# Altium project amplifier.PrjPcb
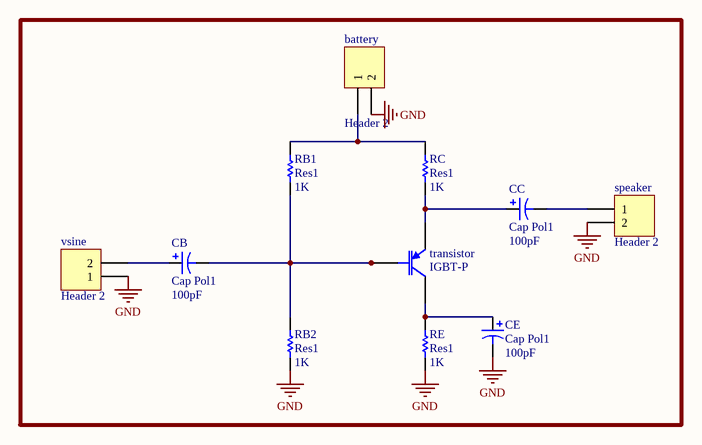
[diagram p0: Sheet2.SchDoc]
1 sheet, 11 parts. Net scope: global (net labels, ports and power ports of the same name join across sheets).
Board file: PCB2.PcbDoc

## Sheet Sheet2.SchDoc
size A4; SheetNumber: 1; SheetTotal: 1; SPICEModelCacheWGIZTEES: <root> / <DocumentId>WGIZTEES</DocumentId> / <CacheFrame Number="0"> / <Model Name="pigbt" Kind="CKT"> / <Text>*PIGBT / *P-IGBT Default  MCE  C G E  5-20-95 / *MCE 600V 40A 24.3ns / *IGBT Pinout: 1=C, 2=G, 3=E / .SUBCKT PIGBT 71 72 74 / Q1  83 81 85     QOUT / M1  81 82 83 83  MFIN L=1U W=1U / DSD 81 83  DO / DBE 81 85  DE / RC  85 71  21.2M / RE  83 73  2.12M / RG  72 82  25.5 / CGE 82 83  1.42N / CGC 82 71  1P / EGD 91  0 81 82  1 / VFB 93  0  0 / FFB 81 82  VFB  1 / CGD 92 93  1.41N / R1  92  0  1 / D1  91 92  DLIM / DHV 94 93  DR / R2  91 94  1 / D2  94  0  DLIM / LE  73 74  7.5N / DLV 94 95  DR 13 / RLV 95  0  1 / ESD 96 93  POLY(1) 81 83  19  1 / MLV 95 96 93 93  SW / .MODEL SW NMOS (LEVEL=3 VTO=0 KP=5) / .MODEL QOUT NPN (IS=377F NF=1.2 BF=5.1 CJE=3.48N TF=24.3N XTB=1.3) / .MODEL MFIN PMOS (LEVEL=3 VMAX=400K THETA=46.1M ETA=2M VTO=-5.2 KP=2.12) / .MODEL DR D (IS=37.7F CJO=100P VJ=1 M=.82) / .MODEL DO D (IS=37.7F BV=600 CJO=2.07N VJ=1 M=.7) / .MODEL DE D (IS=37.7F BV=14.3 N=2) / .MODEL DLIM D (IS=100N) / .ENDS PIGBT</Text> / </Model> / </CacheFrame> / </root>

### Parts
battery  Header 2  [HDR1X2]
CB  Cap Pol1  value 100pF  [RB7.6-15]
CC  Cap Pol1  value 100pF  [RB7.6-15]
CE  Cap Pol1  value 100pF  [RB7.6-15]
RB1  Res1  value 1K  [AXIAL-0.3]
RB2  Res1  value 1K  [AXIAL-0.3]
RC  Res1  value 1K  [AXIAL-0.3]
RE  Res1  value 1K  [AXIAL-0.3]
speaker  Header 2  [HDR1X2]
transistor  IGBT-P  [TO-264-AA]
vsine  Header 2  [HDR1X2]

### Nets
GND: battery.2 CE.2 RB2.1 RE.1 speaker.2 vsine.1
Netbattery_1: battery.1 RB1.2 RC.2
NetCB_1: CB.1 vsine.2
NetCB_2: CB.2 RB1.1 RB2.2 transistor.2(G)
NetCC_1: CC.1 RC.1 transistor.3(E)
NetCC_2: CC.2 speaker.1
NetCE_1: CE.1 RE.2 transistor.1(C)

### Library data of the parts
battery speaker vsine = Header 2: Header, 2-Pin; LatestRevisionDate: 17-Jul-2002; LatestRevisionNote: Re-released for DXP Platform.; Publisher: Altium Limited
CB CC CE = Cap Pol1: Polarized Capacitor (Radial); Published: 8-Jun-2000; LatestRevisionDate: 17-Jul-2002; LatestRevisionNote: Re-released for DXP Platform.; PackageReference: RB7.6-15; Publisher: Altium Limited; PackageDescription: Polarized Capacitor (Radial); 2 Leads
RB1 RB2 RC RE = Res1: Resistor; Published: 8-Jun-2000; LatestRevisionDate: 17-Jul-2002; LatestRevisionNote: Re-released for DXP Platform.; PackageReference: AXIAL-0.3; Publisher: Altium Limited; PackageDescription: Axial Device, Thru-Hole; 2 Leads; 0.3 in Pin Spacing
transistor = IGBT-P: PNP Bipolar Junction Transistor; Published: 8-Jun-2000; LatestRevisionDate: 17-Jul-2002; LatestRevisionNote: Re-released for DXP Platform.; PackageReference: TO-264-AA; Publisher: Altium Limited; Code_JEDEC: TO-264-AA